# EAGLE design MainBoard LARC 2017 (EAGLE 7.5.0)
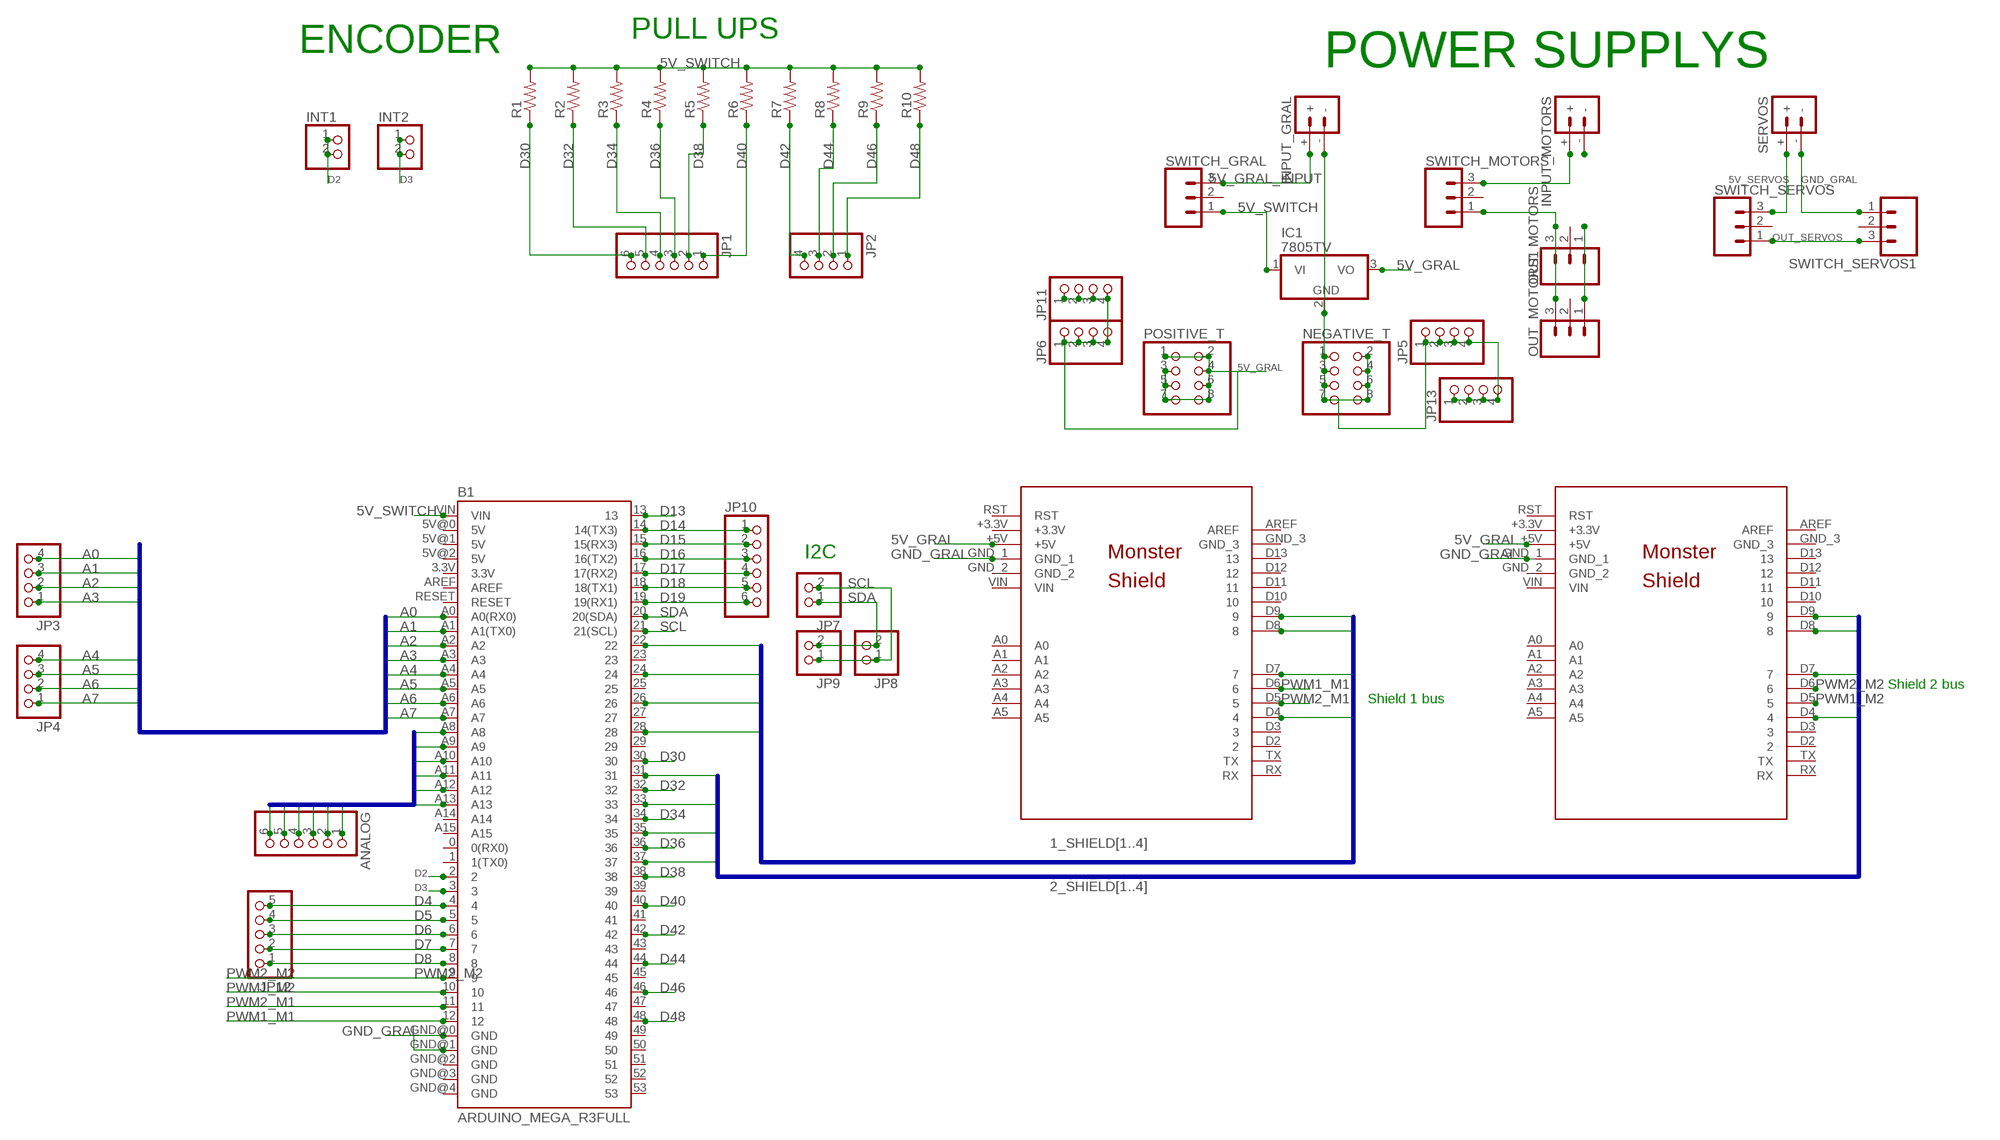
[diagram p0: schematic, sheet 1]

## Parts
ANALOG  PINHD-1X6  [1X06]
B1  ARDUINO_MEGA_R3FULL  [ARDUINO_MEGA]
IC1  7805TV  [TO220V]
INPUT_GRAL  BATTERY_CONN_DEANS  [DEANS]
INPUT_MOTORS  BATTERY_CONN_DEANS  [DEANS]
INT1  PINHD-1X2  [1X02]
INT2  PINHD-1X2  [1X02]
JP1  PINHD-1X6  [1X06]
JP2  PINHD-1X4  [1X04]
JP3  PINHD-1X4  [1X04]
JP4  PINHD-1X4  [1X04]
JP5  PINHD-1X4  [1X04]
JP6  PINHD-1X4  [1X04]
JP7  PINHD-1X2  [1X02]
JP8  PINHD-1X2  [1X02]
JP9  PINHD-1X2  [1X02]
JP10  PINHD-1X6  [1X06]
JP11  PINHD-1X4  [1X04]
JP12  PINHD-1X5  [1X05]
JP13  PINHD-1X4  [1X04]
MS_1  MONSTER_SHIELD  [MONSTER_SHIELD]
MS_2  MONSTER_SHIELD  [MONSTER_SHIELD]
NEGATIVE_T  PINHD-2X4  [2X04]
OUT_MOTORS  CONN_03LONGPADS  [1X03_LONGPADS]
OUT_MOTORS1  CONN_03LONGPADS  [1X03_LONGPADS]
POSITIVE_T  PINHD-2X4  [2X04]
R1  R-US_0207/9  [0207/9]
R2  R-US_0207/9  [0207/9]
R3  R-US_0207/9  [0207/9]
R4  R-US_0207/9  [0207/9]
R5  R-US_0207/9  [0207/9]
R6  R-US_0207/9  [0207/9]
R7  R-US_0207/9  [0207/9]
R8  R-US_0207/9  [0207/9]
R9  R-US_0207/9  [0207/9]
R10  R-US_0207/9  [0207/9]
SERVOS  BATTERY_CONN_DEANS  [DEANS]
SWITCH_GRAL  CONN_03LONGPADS  [1X03_LONGPADS]
SWITCH_MOTORS  CONN_03LONGPADS  [1X03_LONGPADS]
SWITCH_SERVOS  CONN_03LONGPADS  [1X03_LONGPADS]
SWITCH_SERVOS1  CONN_03LONGPADS  [1X03_LONGPADS]

## Nets
1_SHIELD1: B1.28 MS_1.D4
1_SHIELD2: B1.26 MS_1.D7
1_SHIELD3: B1.24 MS_1.D8
1_SHIELD4: B1.22 MS_1.D9
2_SHIELD1: B1.31 MS_2.D4
2_SHIELD2: B1.33 MS_2.D7
2_SHIELD3: B1.35 MS_2.D8
2_SHIELD4: B1.37 MS_2.D9
5V_GRAL: IC1.3(VO) JP6.1 JP6.2 JP6.3 JP6.4 JP11.1 JP11.2 JP11.3 JP11.4 MS_1.+5V MS_2.+5V POSITIVE_T.1 POSITIVE_T.2 POSITIVE_T.3 POSITIVE_T.4 POSITIVE_T.5 POSITIVE_T.6 POSITIVE_T.7 POSITIVE_T.8
5V_GRAL_INPUT: INPUT_GRAL.+ SWITCH_GRAL.3
5V_SERVOS: SERVOS.+ SWITCH_SERVOS.3
5V_SWITCH: B1.VIN IC1.1(VI) R1.2 R2.2 R3.2 R4.2 R5.2 R6.2 R7.2 R8.2 R9.2 R10.2 SWITCH_GRAL.1
A0: B1.A0(A0(RX0)) JP3.4
A1: B1.A1(A1(TX0)) JP3.3
A2: B1.A2 JP3.2
A3: B1.A3 JP3.1
A4: B1.A4 JP4.4
A5: B1.A5 JP4.3
A6: B1.A6 JP4.2
A7: B1.A7 JP4.1
ANALOGS8: ANALOG.6 B1.A8
ANALOGS9: ANALOG.5 B1.A9
ANALOGS10: ANALOG.4 B1.A10
ANALOGS11: ANALOG.3 B1.A11
ANALOGS12: ANALOG.2 B1.A12
ANALOGS13: ANALOG.1 B1.A13
D2: B1.2 INT1.1 INT1.2
D3: B1.3 INT2.1 INT2.2
D4: B1.4 JP12.5
D5: B1.5 JP12.4
D6: B1.6 JP12.3
D7: B1.7 JP12.2
D8: B1.8 JP12.1
D13: B1.13
D14: B1.14(14(TX3)) JP10.1
D15: B1.15(15(RX3)) JP10.2
D16: B1.16(16(TX2)) JP10.3
D17: B1.17(17(RX2)) JP10.4
D18: B1.18(18(TX1)) JP10.5
D19: B1.19(19(RX1)) JP10.6
D30: B1.30 JP1.6 R1.1
D32: B1.32 JP1.5 R2.1
D34: B1.34 JP1.4 R3.1
D36: B1.36 JP1.3 R4.1
D38: B1.38 JP1.2 R5.1
D40: B1.40 JP1.1 R6.1
D42: B1.42 JP2.4 R7.1
D44: B1.44 JP2.3 R8.1
D46: B1.46 JP2.2 R9.1
D48: B1.48 JP2.1 R10.1
GND_GRAL: B1.GND@0(GND) B1.GND@1(GND) IC1.2(GND) INPUT_GRAL.- INPUT_MOTORS.- JP5.1 JP5.2 JP5.3 JP5.4 JP13.1 JP13.2 JP13.3 JP13.4 MS_1.GND_1 MS_2.GND_1 NEGATIVE_T.1 NEGATIVE_T.2 NEGATIVE_T.3 NEGATIVE_T.4 NEGATIVE_T.5 NEGATIVE_T.6 NEGATIVE_T.7 NEGATIVE_T.8 OUT_MOTORS1.1 OUT_MOTORS.1 SERVOS.- SWITCH_SERVOS1.1
N$3: INPUT_MOTORS.+ SWITCH_MOTORS.3
N$4: OUT_MOTORS1.3 OUT_MOTORS.3 SWITCH_MOTORS.1
OUT_SERVOS: SWITCH_SERVOS1.3 SWITCH_SERVOS.1
PWM1_M1: B1.12 MS_1.D6
PWM1_M2: B1.10 MS_2.D5
PWM2_M1: B1.11 MS_1.D5
PWM2_M2: B1.9 MS_2.D6
SCL: B1.21(21(SCL)) JP7.2 JP8.1 JP9.1
SDA: B1.20(20(SDA)) JP7.1 JP8.2 JP9.2
Unconnected: B1.0(0(RX0)) B1.1(1(TX0)) B1.3.3V B1.5V@0(5V) B1.5V@1(5V) B1.5V@2(5V) B1.23 B1.25 B1.27 B1.29 B1.39 B1.41 B1.43 B1.45 B1.47 B1.49 B1.50 B1.51 B1.52 B1.53 B1.A14 B1.A15 B1.AREF B1.GND@2(GND) B1.GND@3(GND) B1.GND@4(GND) B1.RESET MS_1.+3.3V MS_1.A0 MS_1.A1 MS_1.A2 MS_1.A3 MS_1.A4 MS_1.A5 MS_1.AREF MS_1.D2 MS_1.D3 MS_1.D10 MS_1.D11 MS_1.D12 MS_1.D13 MS_1.GND_2 MS_1.GND_3 MS_1.RST MS_1.RX MS_1.TX MS_1.VIN MS_2.+3.3V MS_2.A0 MS_2.A1 MS_2.A2 MS_2.A3 MS_2.A4 MS_2.A5 MS_2.AREF MS_2.D2 MS_2.D3 MS_2.D10 MS_2.D11 MS_2.D12 MS_2.D13 MS_2.GND_2 MS_2.GND_3 MS_2.RST MS_2.RX MS_2.TX MS_2.VIN OUT_MOTORS1.2 OUT_MOTORS.2 SWITCH_GRAL.2 SWITCH_MOTORS.2 SWITCH_SERVOS1.2 SWITCH_SERVOS.2

## Buses
1_SHIELD[1..4]
2_SHIELD[1..4]
A[0..7]
ANALOGS[8..13]

## Notes on the sheet
- PULL UPS
- ENCODER
- POWER SUPPLYS
- I2C
- Shield 2 bus
- Shield 1 bus

## Library data of the parts
ANALOG JP1 JP10 = pinhead:PINHD-1X6: PIN HEADER
B1 = SparkFun-Boards:ARDUINO_MEGA_R3: Arduino Mega R3 ATmega2560 R3 compatible footprint. SparkFun Products: Arduino Mega 2560 R3 <https://www.sparkfun.com/products/11061>
IC1 = linear:78*: Positive VOLTAGE REGULATOR Source: http://cache.national.com/ds/LM/LM78L05.pdf http://www.fairchildsemi.com/ds/LM/LM7805.pdf
INPUT_GRAL INPUT_MOTORS SERVOS = SparkFun-Connectors:BATTERY_CONN: Battery Connectors Various footprints for battery connections SparkFun Products: Deans Connector -M/F Pair <https://www.sparkfun.com/products/11864>; SF_ID: PRT-11864
INT1 INT2 JP7-JP9 = pinhead:PINHD-1X2: PIN HEADER
JP2-JP6 JP11 JP13 = pinhead:PINHD-1X4: PIN HEADER
JP12 = pinhead:PINHD-1X5: PIN HEADER
MS_1 MS_2 = roborregos:MONSTER_SHIELD
NEGATIVE_T POSITIVE_T = adafruit:PINHD-2X4: PIN HEADER
OUT_MOTORS OUT_MOTORS1 SWITCH_GRAL SWITCH_MOTORS SWITCH_SERVOS SWITCH_SERVOS1 = SparkFun-Connectors:CONN_03: Multi connection point. Often used as Generic Header-pin footprint for 0.1 inch spaced/style header connections On any of the 0.1 inch spaced packages, you can populate with these: Break Away Headers - Straight <https://www.sparkfun.com/products/116> (PRT-00116) Break Away Male Headers - Right Angle <https://www.sparkfun.com/products/553> (PRT-00553) Female Headers <https://www.sparkfun.com/products/115> (PRT-00115) Break Away Headers - Machine Pin <https://www.sparkfun.com/products/117> (PRT-00117) Break Away Female Headers - Swiss Machine Pin <https://www.sparkfun.com/products/743> (PRT-00743) Stackable Header - 3 Pin (Female, 0.1") <https://www.sparkfun.com/products/13875> (PRT-13875) For SCREWTERMINALS and SPRING TERMINALS visit here: Screw Terimnals on SparkFun.com <https://www.sparkfun.com/search/results?term=Screw+Terminals> (5mm/3.5mm/2.54mm spacing) This device is also useful as a general connection point to wire up your design to another part of your project. Our various solder wires solder well into these plated through hole pads. Hook-Up Wire - Assortment (Stranded, 22 AWG) <https://www.sparkfun.com/products/11375> (PRT-11375) Hook-Up Wire - Assortment (Solid Core, 22 AWG) <https://www.sparkfun.com/products/11367> (PRT-11367) View the entire wire category on our website here <https://www.sparkfun.com/categories/141> Special notes: Molex polarized connector foot print use with SKU : PRT-08232 with associated crimp pins and housings.
R1-R10 = adafruit:R-US_: RESISTOR, American symbol

## Board
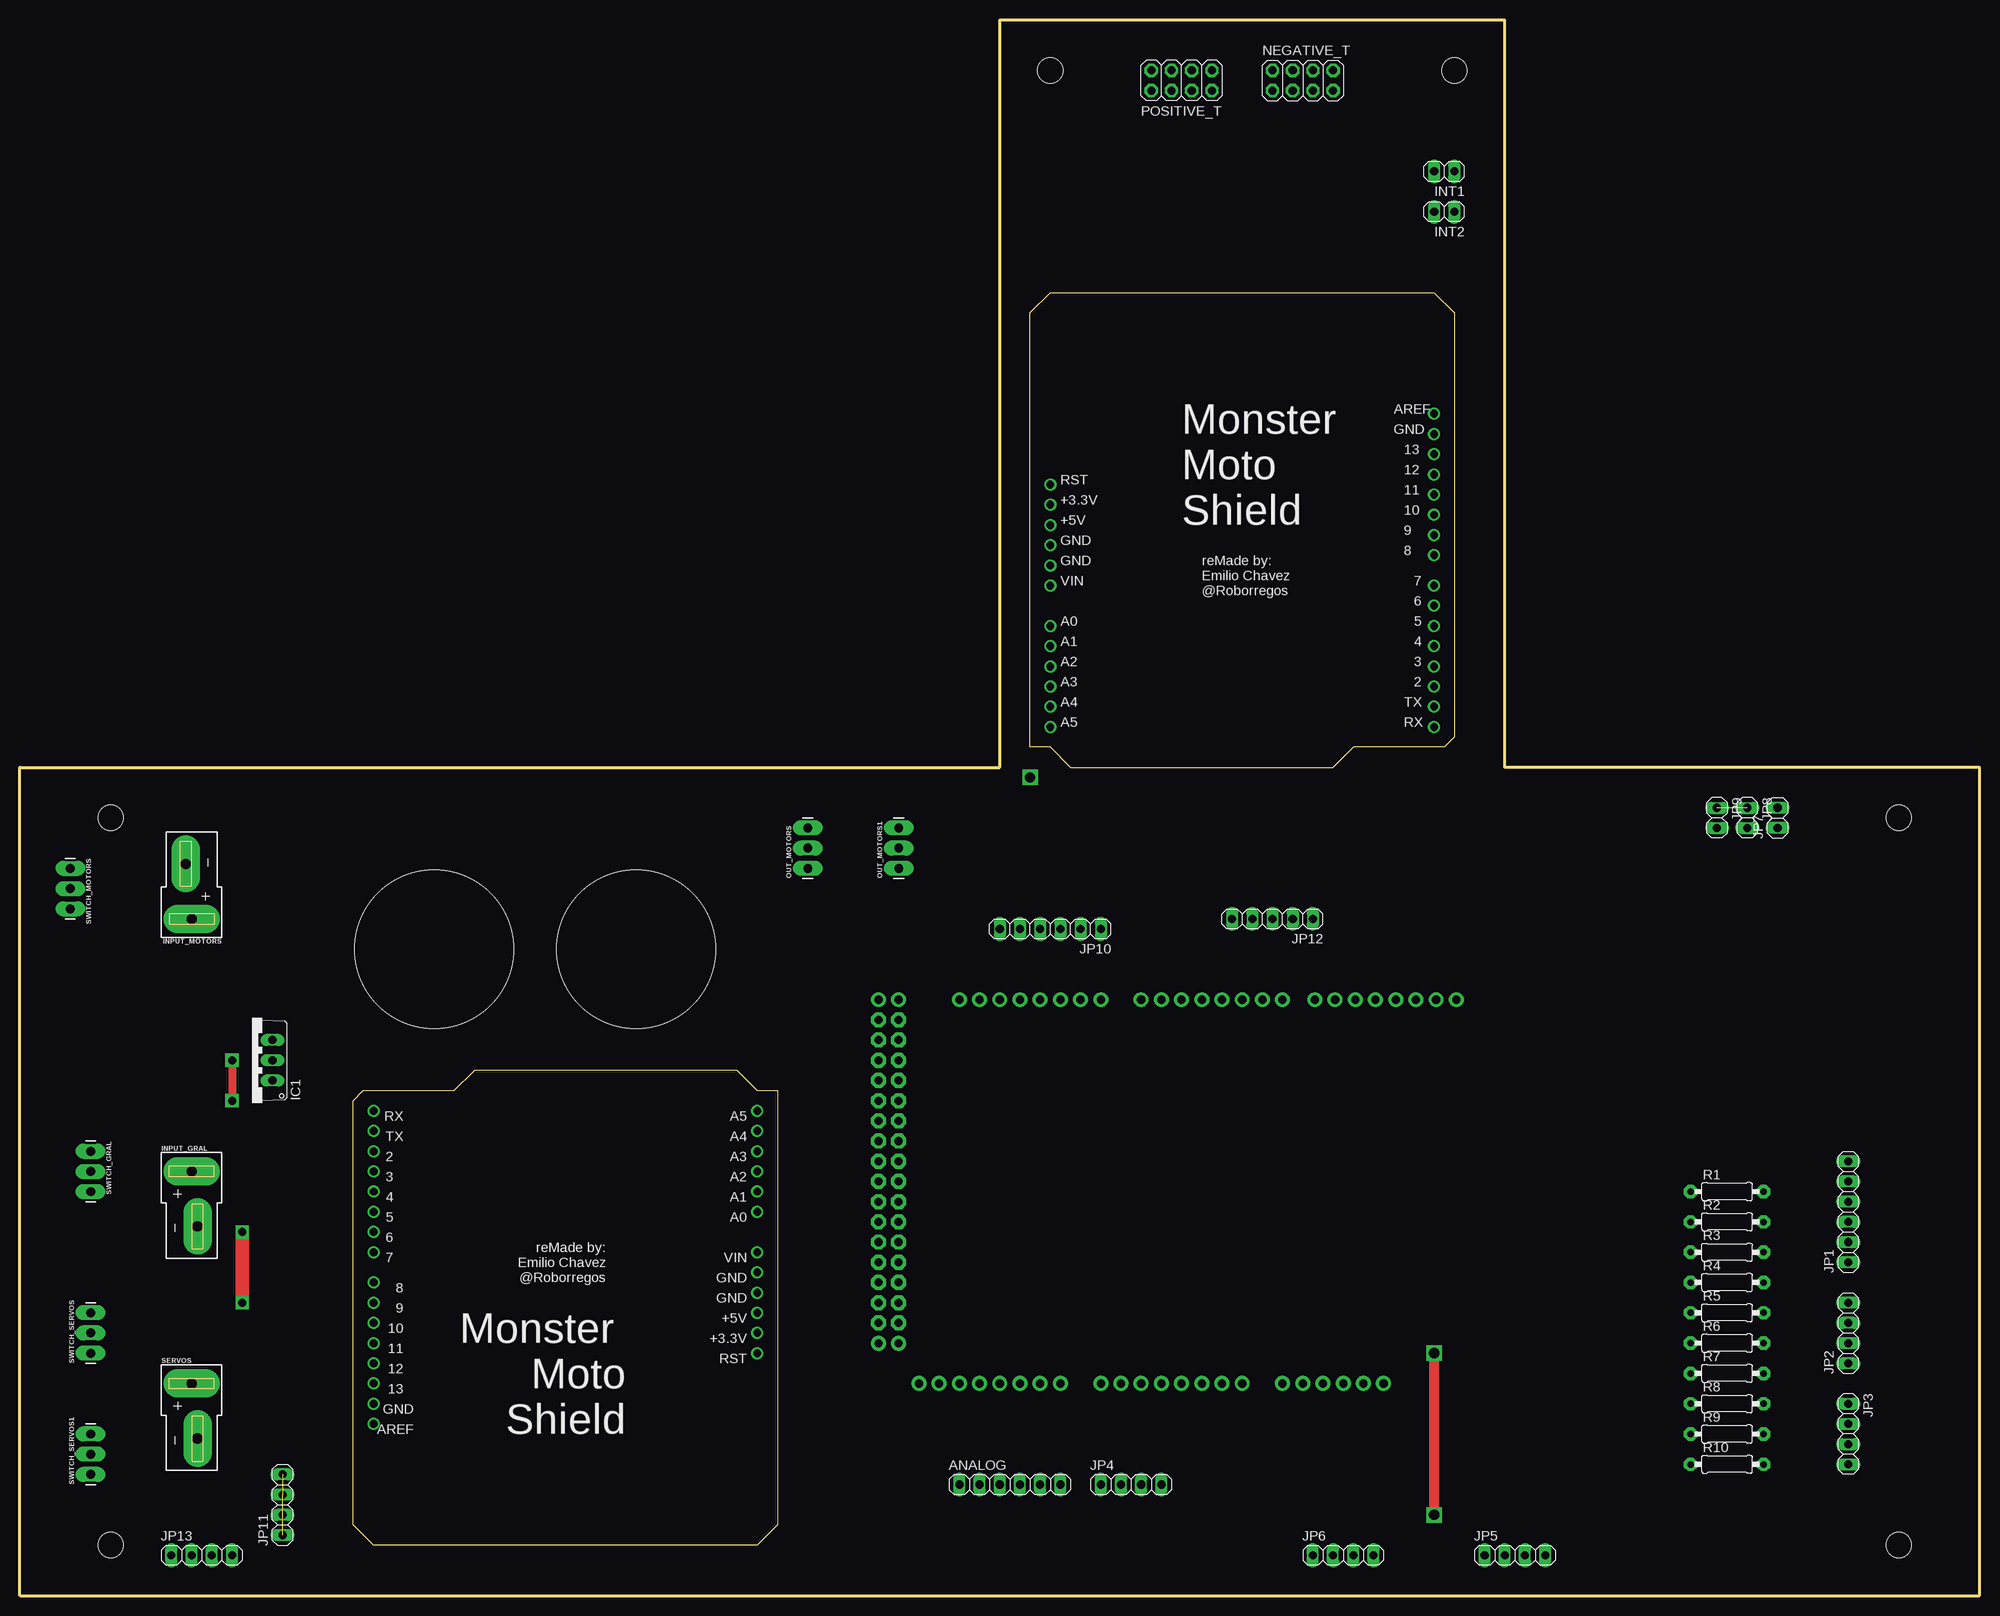
[diagram p1: board, top side]
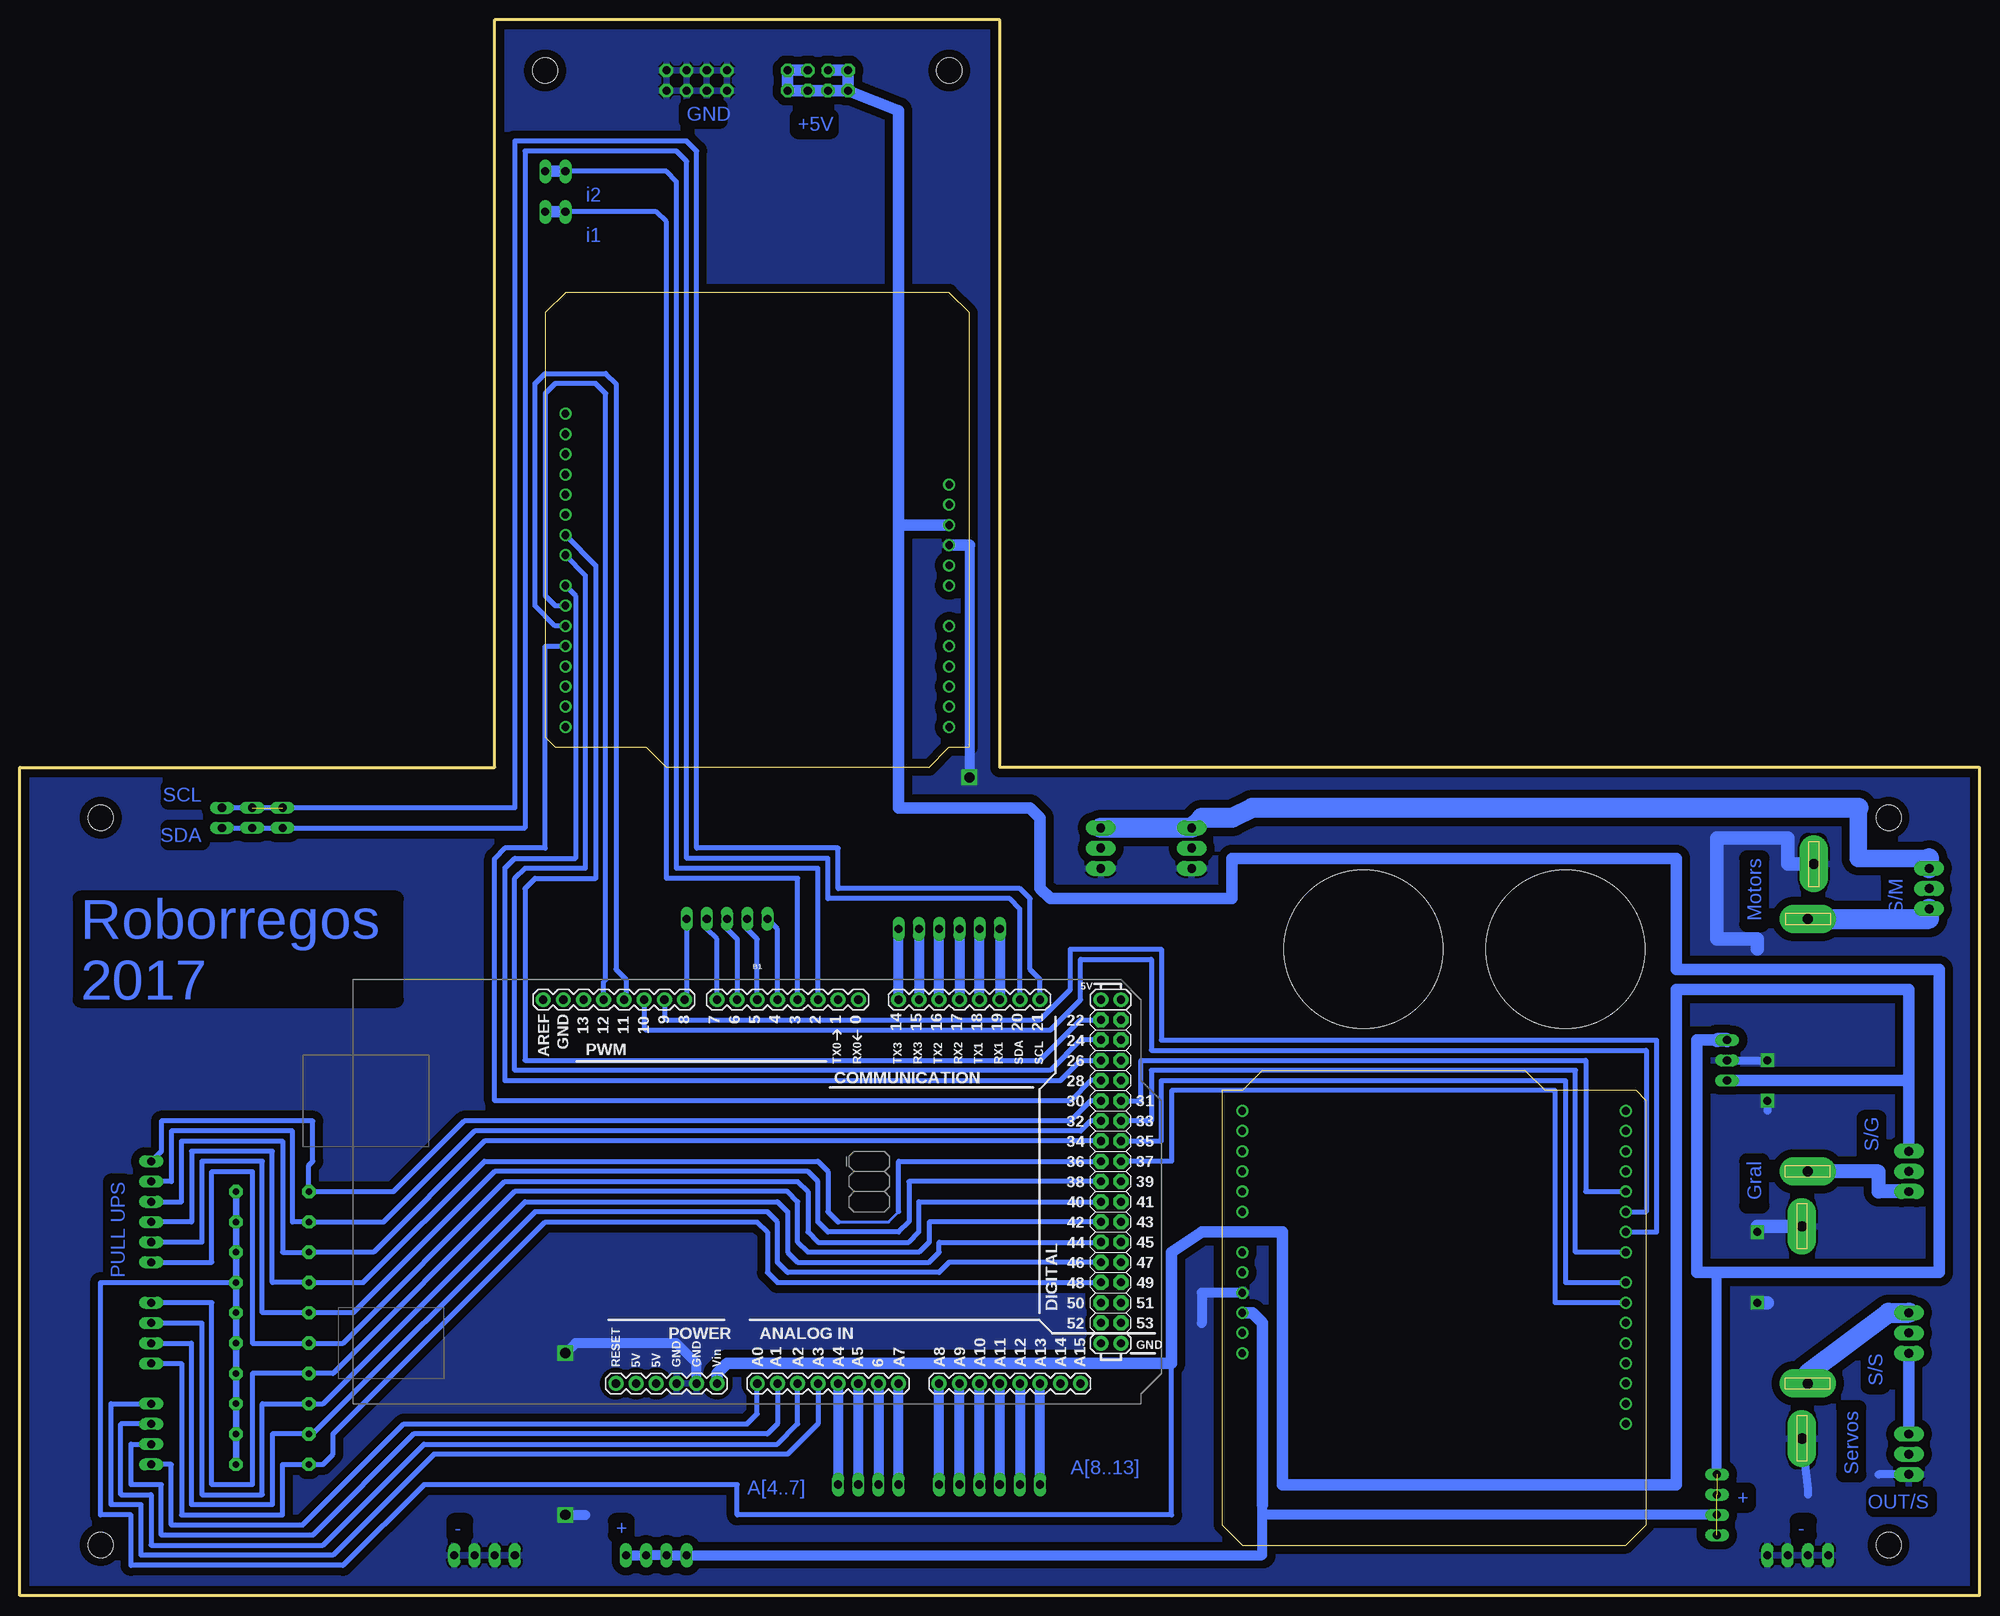
[diagram p2: board, bottom side, seen from below]

Size 246.38 x 198.12 mm. Coordinates in mm from the lower left corner, seen from the top.
Outline: 0,0 246.38,0 246.38,104.14 186.69,104.14 186.69,198.12 123.19,198.12 123.19,104.14 0,104.14 0,0
Copper layers (1*16): Top 0.035mm / dielectric 1.5mm / Bottom 0.035mm
Design rules "default": minimum track width 10mil, minimum drill 24mil, track to track 8mil, track to pad 8mil, pad to pad 8mil, via to via 8mil, smd to smd 8mil, copper to edge 40mil, drill to drill 8mil, minimum pad ring 10mil, minimum via ring 8mil, stop-mask expansion 4mil, vias tented up to drill 0mil, thermal gap 10mil
Holes 3.2 mm at 11.43,97.79 11.43,6.35 236.22,6.35 236.22,97.79 129.54,191.77 180.34,191.77
Holes 20 mm at 52.07,81.28 77.47,81.28

### Footprints (pad centres in the part's own frame; a part is rotated, then mirrored left to right if it is on the bottom)
1X06 = drill 1.016 long: 1 -6.35,0; 2 -3.81,0; 3 -1.27,0; 4 1.27,0; 5 3.81,0; 6 6.35,0
ARDUINO_MEGA = drill 1.016 pad 1.88: 0 13.97,24.13; 1 11.43,24.13; 2 8.89,24.13; 3 6.35,24.13; 3.3V -13.97,-24.13; 4 3.81,24.13; 5 1.27,24.13; 5V@0 -11.43,-24.13; 5V@1 44.45,24.13; 5V@2 46.99,24.13; 6 -1.27,24.13; 7 -3.81,24.13; 8 -7.874,24.13; 9 -10.414,24.13; 10 -12.954,24.13; 11 -15.494,24.13; 12 -18.034,24.13; 13 -20.574,24.13; 14 19.05,24.13; 15 21.59,24.13; 16 24.13,24.13; 17 26.67,24.13; 18 29.21,24.13; 19 31.75,24.13; 20 34.29,24.13; 21 36.83,24.13; A0 1.27,-24.13; A1 3.81,-24.13; A2 6.35,-24.13; A3 8.89,-24.13; A4 11.43,-24.13; A5 13.97,-24.13; A6 16.51,-24.13; A7 19.05,-24.13; A8 24.13,-24.13; A9 26.67,-24.13; A10 29.21,-24.13; A11 31.75,-24.13; A12 34.29,-24.13; A13 36.83,-24.13; A14 39.37,-24.13; A15 41.91,-24.13; AREF -25.654,24.13; GND@0 -8.89,-24.13; GND@1 -6.35,-24.13; GND@2 44.45,-19.05; GND@3 46.99,-19.05; GND@4 -23.114,24.13; RESET -16.51,-24.13; VIN -3.81,-24.13 | drill 1.016 pad 1.88 octagon: 22 44.45,21.59; 23 46.99,21.59; 24 44.45,19.05; 25 46.99,19.05; 26 44.45,16.51; 27 46.99,16.51; 28 44.45,13.97; 29 46.99,13.97; 30 44.45,11.43; 31 46.99,11.43; 32 44.45,8.89; 33 46.99,8.89; 34 44.45,6.35; 35 46.99,6.35; 36 44.45,3.81; 37 46.99,3.81; 38 44.45,1.27; 39 46.99,1.27; 40 44.45,-1.27; 41 46.99,-1.27; 42 44.45,-3.81; 43 46.99,-3.81; 44 44.45,-6.35; 45 46.99,-6.35; 46 44.45,-8.89; 47 46.99,-8.89; 48 44.45,-11.43; 49 46.99,-11.43; 50 44.45,-13.97; 51 46.99,-13.97; 52 44.45,-16.51; 53 46.99,-16.51
TO220V = drill 1.016 long: 1 -2.54,-2.54; 2 0,-2.54; 3 2.54,-2.54
DEANS = drill 1.27 pad 3.556 long: + 0,0; - 0.737,-6.921
1X02 = drill 1.016 long: 1 -1.27,0; 2 1.27,0
1X04 = drill 1.016 long: 1 -3.81,0; 2 -1.27,0; 3 1.27,0; 4 3.81,0
1X05 = drill 1.016 long: 1 -5.08,0; 2 -2.54,0; 3 0,0; 4 2.54,0; 5 5.08,0
MONSTER_SHIELD = drill 1: +3.3V -3.81,2.54; +5V -3.81,0; A0 -3.81,-12.7; A1 -3.81,-15.24; A2 -3.81,-17.78; A3 -3.81,-20.32; A4 -3.81,-22.86; A5 -3.81,-25.4; AREF 44.45,13.97; D2 44.45,-20.32; D3 44.45,-17.78; D4 44.45,-15.24; D5 44.45,-12.7; D6 44.45,-10.16; D7 44.45,-7.62; D8 44.45,-3.81; D9 44.45,-1.27; D10 44.45,1.27; D11 44.45,3.81; D12 44.45,6.35; D13 44.45,8.89; GND_1 -3.81,-2.54; GND_2 -3.81,-5.08; GND_3 44.45,11.43; RST -3.81,5.08; RX 44.45,-22.86; TX 44.45,-25.4; VIN -3.81,-7.62
2X04 = drill 1.016 pad 1.676 octagon: 1 -3.81,-1.27; 2 -3.81,1.27; 3 -1.27,-1.27; 4 -1.27,1.27; 5 1.27,-1.27; 6 1.27,1.27; 7 3.81,-1.27; 8 3.81,1.27
1X03_LONGPADS = drill 1.118 pad 1.88 long: 1 0,0; 2 2.54,0; 3 5.08,0
0207/9 = drill 0.813 pad 1.676 octagon: 1 -4.572,0; 2 4.572,0

### Placement (x,y rotation side)
ANALOG  124.46,13.97 0 top
B1  154.94,50.8 0 bottom
IC1  29.21,67.31 90 top
INPUT_GRAL  21.59,53.34 0 top
INPUT_MOTORS  21.59,85.09 180 top
INT1  179.07,179.07 180 top
INT2  179.07,173.99 180 top
JP1  229.87,48.26 90 top
JP2  229.87,33.02 90 top
JP3  229.87,20.32 270 top
JP4  139.7,13.97 0 top
JP5  187.96,5.08 0 top
JP6  166.37,5.08 0 top
JP7  220.98,97.79 90 top
JP8  217.17,97.79 270 top
JP9  213.36,97.79 270 top
JP10  129.54,83.82 180 top
JP11  33.02,11.43 90 top
JP12  157.48,85.09 180 top
JP13  22.86,5.08 0 top
MS_1  133.35,134.62 0 top
MS_2  88.9,35.56 180 top
NEGATIVE_T  161.29,190.5 0 top
OUT_MOTORS  99.06,91.44 90 top
OUT_MOTORS1  110.49,91.44 90 top
POSITIVE_T  146.05,190.5 180 top
R1  214.63,50.8 0 top
R2  214.63,46.99 0 top
R3  214.63,43.18 0 top
R4  214.63,39.37 0 top
R5  214.63,35.56 0 top
R6  214.63,31.75 0 top
R7  214.63,27.94 0 top
R8  214.63,24.13 0 top
R9  214.63,20.32 0 top
R10  214.63,16.51 0 top
SERVOS  21.59,26.67 0 top
SWITCH_GRAL  8.89,55.88 270 top
SWITCH_MOTORS  6.35,91.44 270 top
SWITCH_SERVOS  8.89,30.48 90 top
SWITCH_SERVOS1  8.89,15.24 90 top

### Tracks (layer width: path | path; a pad name or v marks a point on that pad's centre or on a via)
1_SHIELD1
  Bottom 0.61: MS_1.D4 180.34,119.38 180.34,93.98 185.42,93.98 186.69,92.71 186.69,62.23 114.3,62.23 111.76,64.77 B1.28
1_SHIELD2
  Bottom 0.61: MS_1.D7 176.53,125.73 176.53,92.71 184.15,92.71 185.42,91.44 185.42,64.77 115.57,64.77 113.03,67.31 B1.26
1_SHIELD3
  Bottom 0.61: MS_1.D8 175.26,128.27 175.26,91.44 182.88,91.44 184.15,90.17 184.15,66.04 116.84,66.04 113.03,69.85 B1.24
1_SHIELD4
  Bottom 0.61: MS_1.D9 173.99,129.54 173.99,90.17 181.61,90.17 182.88,88.9 182.88,67.31 118.11,67.31 113.03,72.39 B1.22
2_SHIELD1
  Bottom 0.61: B1.31 105.41,62.23 105.41,67.31 49.53,67.31 49.53,50.8 MS_2.D4
2_SHIELD2
  Bottom 0.61: MS_2.D7 50.8,43.18 50.8,66.04 104.14,66.04 104.14,59.69 B1.33
2_SHIELD3
  Bottom 0.61: B1.35 102.87,57.15 102.87,64.77 52.07,64.77 52.07,39.37 MS_2.D8
2_SHIELD4
  Bottom 0.61: MS_2.D9 53.34,36.83 53.34,63.5 101.6,63.5 101.6,54.61 B1.37
5V_GRAL  (3 unrouted)
  Bottom 1.27: JP6.4 JP6.3 JP6.2 JP6.1 90.17,5.08 90.17,10.16 | JP11.4 33.02,40.64 | JP11.2 90.17,10.16 | 90.17,10.16 90.17,11.43
  Bottom 1.422: MS_2.+5V 91.44,35.56 90.17,34.29 90.17,11.43 | POSITIVE_T.8 POSITIVE_T.6 POSITIVE_T.4 POSITIVE_T.2 POSITIVE_T.1 POSITIVE_T.3 | POSITIVE_T.5 POSITIVE_T.7 POSITIVE_T.8 | 135.89,134.62 135.89,186.69 POSITIVE_T.8 | MS_1.+5V 135.89,134.62 | 135.89,134.62 135.89,99.06 119.38,99.06 118.11,97.79 118.11,88.9 116.84,87.63 93.98,87.63 93.98,92.71 38.1,92.71 38.1,78.74 5.08,78.74 5.08,40.64 33.02,40.64 35.56,40.64 35.56,69.85 IC1.3
  Bottom 1.778: IC1.3 33.02,69.85
5V_GRAL_INPUT
  Bottom 1.778: SWITCH_GRAL.3 12.7,50.8 12.7,53.34 INPUT_GRAL.+
5V_SERVOS
  Bottom 2.184: 21.59,27.94 SERVOS.+
  Bottom 2.54: SWITCH_SERVOS.3 11.43,35.56 21.59,27.94
5V_SWITCH
  Bottom 0.61: 101.6,29.21 101.6,10.16 156.21,10.16 156.21,13.97 195.58,13.97 205.74,3.81 232.41,3.81 232.41,10.16 236.22,10.16 236.22,39.37 R4.2
  Bottom 0.813: R1.2 R2.2 R3.2 R4.2 R5.2 R6.2 R7.2 R8.2 R9.2 R10.2
  Bottom 1.422: SWITCH_GRAL.1 8.89,64.77 | 8.89,64.77 IC1.1 | B1.VIN 158.75,27.94 157.48,29.21 101.6,29.21 101.6,43.18 97.79,45.72 87.63,45.72 87.63,13.97 38.1,13.97 38.1,76.2 8.89,76.2 8.89,64.77
A0
  Bottom 0.61: B1.A0 153.67,22.86 154.94,21.59 198.12,21.59 210.82,8.89 227.33,8.89 227.33,16.51 JP3.4
A1
  Bottom 0.61: B1.A1 151.13,21.59 152.4,20.32 196.85,20.32 209.55,7.62 228.6,7.62 228.6,13.97 232.41,13.97 232.41,19.05 JP3.3
A2
  Bottom 0.61: B1.A2 148.59,21.59 151.13,19.05 195.58,19.05 208.28,6.35 229.87,6.35 229.87,12.7 233.68,12.7 233.68,21.59 JP3.2
A3
  Bottom 0.61: B1.A3 146.05,21.59 149.86,17.78 194.31,17.78 207.01,5.08 231.14,5.08 231.14,11.43 234.95,11.43 234.95,24.13 JP3.1
A4
  Bottom 1.27: B1.A4 JP4.4
A5
  Bottom 1.27: JP4.3 B1.A5
A6
  Bottom 1.27: B1.A6 JP4.2
A7
  Bottom 1.27: JP4.1 B1.A7
ANALOGS8
  Bottom 1.27: ANALOG.6 B1.A8
ANALOGS9
  Bottom 1.27: ANALOG.5 B1.A9
ANALOGS10
  Bottom 1.27: ANALOG.4 B1.A10
ANALOGS11
  Bottom 1.27: ANALOG.3 B1.A11
ANALOGS12
  Bottom 1.27: B1.A12 ANALOG.2
ANALOGS13
  Bottom 1.27: ANALOG.1 B1.A13
D2
  Bottom 0.61: B1.2 146.05,91.44 163.83,91.44 163.83,177.8 165.1,179.07 INT1.2
  Bottom 1.422: INT1.2 INT1.1
D3
  Bottom 0.61: B1.3 148.59,90.17 165.1,90.17 165.1,172.72 166.37,173.99 INT2.2
  Bottom 1.422: INT2.2 INT2.1
D4
  Bottom 0.61: B1.4 151.13,83.82 JP12.5
D5
  Bottom 0.61: B1.5 153.67,82.55 154.94,83.82 JP12.4
D6
  Bottom 0.61: JP12.3 157.48,83.82 156.21,82.55 B1.6
D7
  Bottom 0.61: B1.7 158.75,82.55 160.02,83.82 JP12.2
D8
  Bottom 0.61: JP12.1 162.56,75.18 B1.8
D14
  Bottom 1.27: B1.14 JP10.1
D15
  Bottom 1.27: JP10.2 B1.15
D16
  Bottom 1.27: B1.16 JP10.3
D17
  Bottom 1.27: JP10.4 B1.17
D18
  Bottom 1.27: B1.18 JP10.5
D19
  Bottom 1.27: JP10.6 B1.19
D30
  Bottom 0.61: JP1.6 228.6,55.88 228.6,59.69 209.55,59.69 209.55,54.61 210.06,54.1 R1.1 199.39,50.8 190.5,59.69 114.3,59.69 111.76,62.23 B1.30
D32
  Bottom 0.406: 228.6,52.07 JP1.5
  Bottom 0.61: 228.6,52.07 227.33,52.07 227.33,58.42 212.09,58.42 212.09,46.99 R2.1 200.66,46.99 189.23,58.42 113.03,58.42 111.76,59.69 B1.32
D34
  Bottom 0.406: JP1.4 228.6,49.53
  Bottom 0.61: B1.34 187.96,57.15 201.93,43.18 R3.1 213.36,43.18 213.36,57.15 226.06,57.15 226.06,49.53 228.6,49.53
D36
  Bottom 0.406: 143.51,46.99 137.16,46.99 135.89,48.26 | 228.6,46.99 JP1.3
  Bottom 0.61: 143.51,46.99 144.78,48.26 144.78,53.34 146.05,54.61 187.96,54.61 203.2,39.37 R4.1 214.63,39.37 214.63,55.88 224.79,55.88 224.79,46.99 228.6,46.99 | 135.89,48.26 135.89,54.61 B1.36
D38
  Bottom 0.406: 228.6,44.45 JP1.2
  Bottom 0.61: B1.38 134.62,52.07 134.62,46.99 135.89,45.72 144.78,45.72 146.05,46.99 146.05,52.07 147.32,53.34 186.69,53.34 204.47,35.56 R5.1 215.9,35.56 215.9,54.61 223.52,54.61 223.52,44.45 228.6,44.45
D40
  Bottom 0.406: JP1.1 228.6,41.91
  Bottom 0.61: B1.40 133.35,49.53 133.35,45.72 134.62,44.45 146.05,44.45 147.32,45.72 147.32,50.8 148.59,52.07 185.42,52.07 205.74,31.75 R6.1 217.17,31.75 217.17,53.34 222.25,53.34 222.25,41.91 228.6,41.91
D42
  Bottom 0.61: B1.42 132.08,46.99 132.08,44.45 133.35,43.18 147.32,43.18 148.59,44.45 148.59,49.53 149.86,50.8 184.15,50.8 207.01,27.94 R7.1 217.17,27.94 217.17,13.97 222.25,13.97 222.25,36.83 JP2.4
D44
  Bottom 0.61: B1.44 130.81,44.45 130.81,43.18 132.08,41.91 148.59,41.91 149.86,43.18 149.86,48.26 151.13,49.53 182.88,49.53 208.28,24.13 R8.1 215.9,24.13 215.9,12.7 223.52,12.7 223.52,34.29 JP2.3
D46
  Bottom 0.406: 209.55,20.32 R9.1
  Bottom 0.61: B1.46 129.54,41.91 130.81,40.64 149.86,40.64 151.13,41.91 151.13,46.99 152.4,48.26 181.61,48.26 209.55,20.32 | R9.1 214.63,20.32 214.63,11.43 224.79,11.43 224.79,31.75 JP2.2
D48
  Bottom 0.61: B1.48 151.13,39.37 152.4,40.64 152.4,45.72 153.67,46.99 180.34,46.99 207.01,20.32 207.01,17.78 208.28,16.51 R10.1 213.36,16.51 213.36,10.16 226.06,10.16 226.06,29.21 JP2.1
GND_GRAL  (via drill 1 pad 1.68, 1.3)
  Top 1.016: v26.67,67.31 v26.67,62.23
  Top 1.27: v177.8,30.48 v177.8,10.16
  Top 1.676: v27.94,45.72 v27.94,36.83
  Bottom 1.016: IC1.2 v26.67,67.31 | v26.67,62.23 26.67,60.96 | SWITCH_SERVOS1.1 12.7,15.24 | SERVOS.- 21.59,13.4 21.59,12.7
  Bottom 1.27: B1.GND@1 161.29,29.21 163.83,31.75 176.53,31.75 v177.8,30.48 | v177.8,10.16 175.26,10.16 | MS_2.GND_1 97.79,38.1 97.79,34.29 | 127,132.08 v127,102.87
  Bottom 1.422: MS_1.GND_1 127,132.08
  Bottom 1.676: INPUT_GRAL.- 27.94,46.42 v27.94,45.72 | v27.94,36.83 26.67,36.83 | INPUT_MOTORS.- 24.13,92.01 24.13,95.25 33.02,95.25 33.02,82.55 27.94,82.55 27.94,81.28
  pour Bottom (isolate 1.016): 0,104.14 0,0 246.38,0 246.38,104.14 186.69,104.14 186.69,198.12 123.19,198.12 123.19,104.14
N$3
  Bottom 2.54: INPUT_MOTORS.+ 6.35,85.09 SWITCH_MOTORS.3
N$4
  Bottom 2.184: 6.35,92.71 15.24,92.71 15.24,99.06
  Bottom 2.54: SWITCH_MOTORS.1 6.35,92.71 | 15.24,99.06 91.44,99.06 93.98,97.79 97.79,97.79 OUT_MOTORS.3 OUT_MOTORS1.3
OUT_SERVOS
  Bottom 1.422: SWITCH_SERVOS.1 SWITCH_SERVOS1.3
PWM1_M1
  Bottom 0.61: B1.12 172.97,77.22 172.72,77.47 172.72,151.13 173.99,152.4 179.07,152.4 180.34,151.13 180.34,125.73 179.07,124.46 MS_1.D6
PWM1_M2
  Bottom 0.61: B1.10 167.89,71.37 167.64,71.12 116.84,71.12 113.03,74.93 113.03,80.01 104.14,80.01 104.14,68.58 41.91,68.58 41.91,48.26 MS_2.D5
PWM2_M1
  Bottom 0.61: MS_1.D5 179.07,121.92 181.61,124.46 181.61,152.4 180.34,153.67 172.72,153.67 171.45,152.4 171.45,78.74 170.18,77.47 170.18,75.18 B1.11
PWM2_M2
  Bottom 0.61: B1.9 165.35,72.64 165.1,72.39 118.11,72.39 114.3,76.2 114.3,81.28 102.87,81.28 102.87,69.85 40.64,69.85 40.64,45.72 MS_2.D6
SCL  (1 unrouted)
  Bottom 0.61: B1.21 118.11,77.47 119.38,78.74 119.38,87.63 120.65,88.9 143.51,88.9 143.51,93.98 161.29,93.98 161.29,181.61 162.56,182.88 184.15,182.88 184.15,99.06 JP7.2 JP8.1
SDA
  Bottom 0.61: B1.20 120.65,86.36 121.92,87.63 144.78,87.63 144.78,92.71 162.56,92.71 162.56,180.34 163.83,181.61 182.88,181.61 182.88,96.52 JP7.1 JP8.2 JP9.2

### Text on the board
Bottom: GND | +5V | i2 | i1 | SCL | SDA | Motors | S/M | Roborregos / 2017 | S/G | Gral | PULL UPS | S/S | Servos | A[8..13] | OUT/S | A[4..7] | + | - | + | -